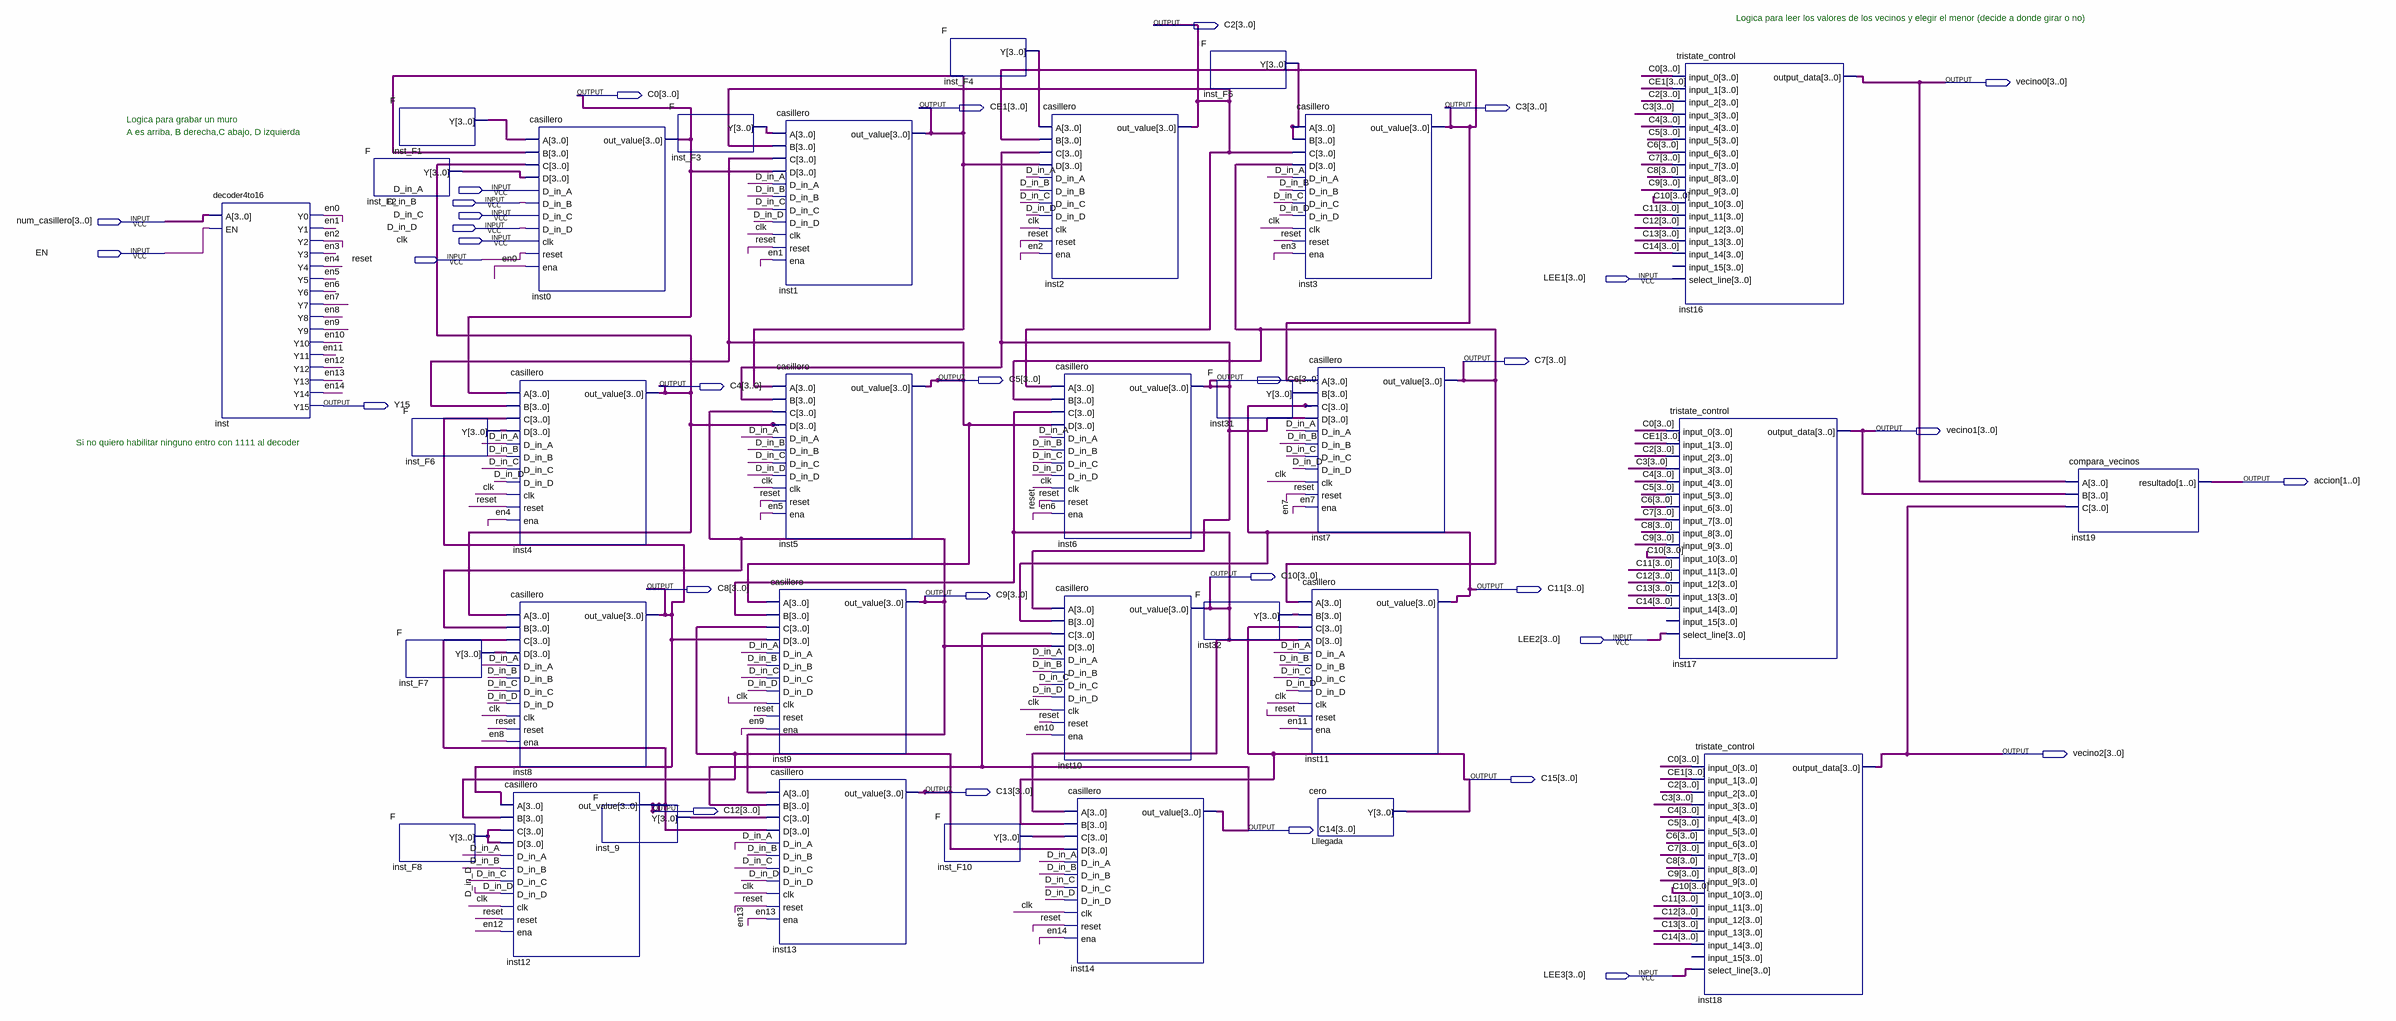
[diagram p0: schematic sheet]
// Quartus schematic matriz_pru.bdf as structural Verilog: 33 symbols, 32 pins
module matriz_pru (
  input  D_in_A,
  input  D_in_B,
  input  D_in_C,
  input  [3:0] num_casillero,
  input  D_in_D,
  input  clk,
  input  EN,
  input  reset,
  input  [3:0] LEE1,
  input  [3:0] LEE2,
  input  [3:0] LEE3,
  output [3:0] C2,
  output [3:0] vecino0,
  output [3:0] C0,
  output [3:0] CE1,
  output [3:0] C3,
  output [3:0] C7,
  output [3:0] C5,
  output [3:0] C6,
  output [3:0] C4,
  output Y15,
  output [3:0] vecino1,
  output [1:0] accion,
  output [3:0] C10,
  output [3:0] C8,
  output [3:0] C11,
  output [3:0] C9,
  output [3:0] vecino2,
  output [3:0] C15,
  output [3:0] C13,
  output [3:0] C12,
  output [3:0] C14
);

  wire en0, en1, en2, en3, en4, en5, en6, en7, en8, en9, en10, en11, en12, en13, en14;
  wire [3:0] inst31_y, inst32_y, inst_9_y, inst_F1_y, inst_F2_y, inst_F3_y, inst_F4_y, inst_F5_y, inst_F6_y,
       inst_F7_y, inst_F8_y, inst_F10_y;

  decoder4to16 inst (
    .A(num_casillero), .EN(EN), .Y0(en0), .Y1(en1), .Y2(en2), .Y3(en3), .Y4(en4), .Y5(en5), .Y6(en6),
    .Y7(en7), .Y8(en8), .Y9(en9), .Y10(en10), .Y11(en11), .Y12(en12), .Y13(en13), .Y14(en14), .Y15(Y15));
  F inst_F1 (.Y(inst_F1_y));
  F inst_F2 (.Y(inst_F2_y));
  F inst_F6 (.Y(inst_F6_y));
  F inst_F7 (.Y(inst_F7_y));
  F inst_F8 (.Y(inst_F8_y));
  casillero inst12 (
    .A(C8), .B(C13), .C(inst_F8_y), .D(inst_F8_y), .D_in_A(D_in_A), .D_in_B(D_in_B), .D_in_C(D_in_C),
    .D_in_D(D_in_D), .clk(clk), .reset(reset), .ena(en12), .out_value(C12));
  casillero inst0 (
    .A(inst_F1_y), .B(CE1), .C(C4), .D(inst_F2_y), .D_in_A(D_in_A), .D_in_B(D_in_B), .D_in_C(D_in_C),
    .D_in_D(D_in_D), .clk(clk), .reset(reset), .ena(en0), .out_value(C0));
  casillero inst4 (
    .A(C0), .B(C5), .C(C8), .D(inst_F6_y), .D_in_A(D_in_A), .D_in_B(D_in_B), .D_in_C(D_in_C),
    .D_in_D(D_in_D), .clk(clk), .reset(reset), .ena(en4), .out_value(C4));
  casillero inst8 (
    .A(C4), .B(C9), .C(C12), .D(inst_F7_y), .D_in_A(D_in_A), .D_in_B(D_in_B), .D_in_C(D_in_C),
    .D_in_D(D_in_D), .clk(clk), .reset(reset), .ena(en8), .out_value(C8));
  F inst_9 (.Y(inst_9_y));
  F inst_F3 (.Y(inst_F3_y));
  casillero inst1 (
    .A(inst_F3_y), .B(C2), .C(C5), .D(C0), .D_in_A(D_in_A), .D_in_B(D_in_B), .D_in_C(D_in_C),
    .D_in_D(D_in_D), .clk(clk), .reset(reset), .ena(en1), .out_value(CE1));
  casillero inst5 (
    .A(CE1), .B(C6), .C(C9), .D(C4), .D_in_A(D_in_A), .D_in_B(D_in_B), .D_in_C(D_in_C), .D_in_D(D_in_D),
    .clk(clk), .reset(reset), .ena(en5), .out_value(C5));
  casillero inst9 (
    .A(C5), .B(C10), .C(C13), .D(C8), .D_in_A(D_in_A), .D_in_B(D_in_B), .D_in_C(D_in_C), .D_in_D(D_in_D),
    .clk(clk), .reset(reset), .ena(en9), .out_value(C9));
  casillero inst13 (
    .A(C9), .B(C14), .C(inst_9_y), .D(C12), .D_in_A(D_in_A), .D_in_B(D_in_B), .D_in_C(D_in_C),
    .D_in_D(D_in_D), .clk(clk), .reset(reset), .ena(en13), .out_value(C13));
  F inst_F4 (.Y(inst_F4_y));
  F inst_F10 (.Y(inst_F10_y));
  casillero inst2 (
    .A(inst_F4_y), .B(C3), .C(C6), .D(CE1), .D_in_A(D_in_A), .D_in_B(D_in_B), .D_in_C(D_in_C),
    .D_in_D(D_in_D), .clk(clk), .reset(reset), .ena(en2), .out_value(C2));
  casillero inst6 (
    .A(C2), .B(C7), .C(C10), .D(C5), .D_in_A(D_in_A), .D_in_B(D_in_B), .D_in_C(D_in_C), .D_in_D(D_in_D),
    .clk(clk), .reset(reset), .ena(en6), .out_value(C6));
  casillero inst10 (
    .A(C6), .B(C11), .C(C14), .D(C9), .D_in_A(D_in_A), .D_in_B(D_in_B), .D_in_C(D_in_C), .D_in_D(D_in_D),
    .clk(clk), .reset(reset), .ena(en10), .out_value(C10));
  casillero inst14 (
    .A(C10), .B(C15), .C(inst_F10_y), .D(C13), .D_in_A(D_in_A), .D_in_B(D_in_B), .D_in_C(D_in_C),
    .D_in_D(D_in_D), .clk(clk), .reset(reset), .ena(en14), .out_value(C14));
  F inst_F5 (.Y(inst_F5_y));
  F inst31 (.Y(inst31_y));
  F inst32 (.Y(inst32_y));
  casillero inst3 (
    .A(inst_F5_y), .B(inst_F5_y), .C(C2), .D(C7), .D_in_A(D_in_A), .D_in_B(D_in_B), .D_in_C(D_in_C),
    .D_in_D(D_in_D), .clk(clk), .reset(reset), .ena(en3), .out_value(C3));
  casillero inst7 (
    .A(C3), .B(inst31_y), .C(C11), .D(C6), .D_in_A(D_in_A), .D_in_B(D_in_B), .D_in_C(D_in_C),
    .D_in_D(D_in_D), .clk(clk), .reset(reset), .ena(en7), .out_value(C7));
  casillero inst11 (
    .A(C7), .B(inst32_y), .C(C15), .D(C10), .D_in_A(D_in_A), .D_in_B(D_in_B), .D_in_C(D_in_C),
    .D_in_D(D_in_D), .clk(clk), .reset(reset), .ena(en11), .out_value(C11));
  cero Lllegada (.Y(C15));
  tristate_control inst17 (
    .input_0(C0), .input_1(CE1), .input_2(C2), .input_3(C3), .input_4(C4), .input_5(C5), .input_6(C6),
    .input_7(C7), .input_8(C8), .input_9(C9), .input_10(C10), .input_11(C11), .input_12(C12), .input_13(C13),
    .input_14(C14), .select_line(LEE2), .output_data(vecino1));  // open: input_15
  tristate_control inst16 (
    .input_0(C0), .input_1(CE1), .input_2(C2), .input_3(C3), .input_4(C4), .input_5(C5), .input_6(C6),
    .input_7(C7), .input_8(C8), .input_9(C9), .input_10(C10), .input_11(C11), .input_12(C12), .input_13(C13),
    .input_14(C14), .select_line(LEE1), .output_data(vecino0));  // open: input_15
  tristate_control inst18 (
    .input_0(C0), .input_1(CE1), .input_2(C2), .input_3(C3), .input_4(C4), .input_5(C5), .input_6(C6),
    .input_7(C7), .input_8(C8), .input_9(C9), .input_10(C10), .input_11(C11), .input_12(C12), .input_13(C13),
    .input_14(C14), .select_line(LEE3), .output_data(vecino2));  // open: input_15
  compara_vecinos inst19 (.A(vecino0), .B(vecino1), .C(vecino2), .resultado(accion));

  // Notes on the sheet:
  //   Logica para leer los valores de los vecinos y elegir el menor (decide a donde girar o no)
  //   Logica para grabar un muro
  //   A es arriba, B derecha,C abajo, D izquierda
  //   Si no quiero habilitar ninguno entro con 1111 al decoder
endmodule
